# Altium project OMODRI.PrjPcb (part 2 of 5)

## Sheet OMODRI_Gate_Driver_2.SchDoc
size A3; SheetNumber: 2; SheetTotal: 4
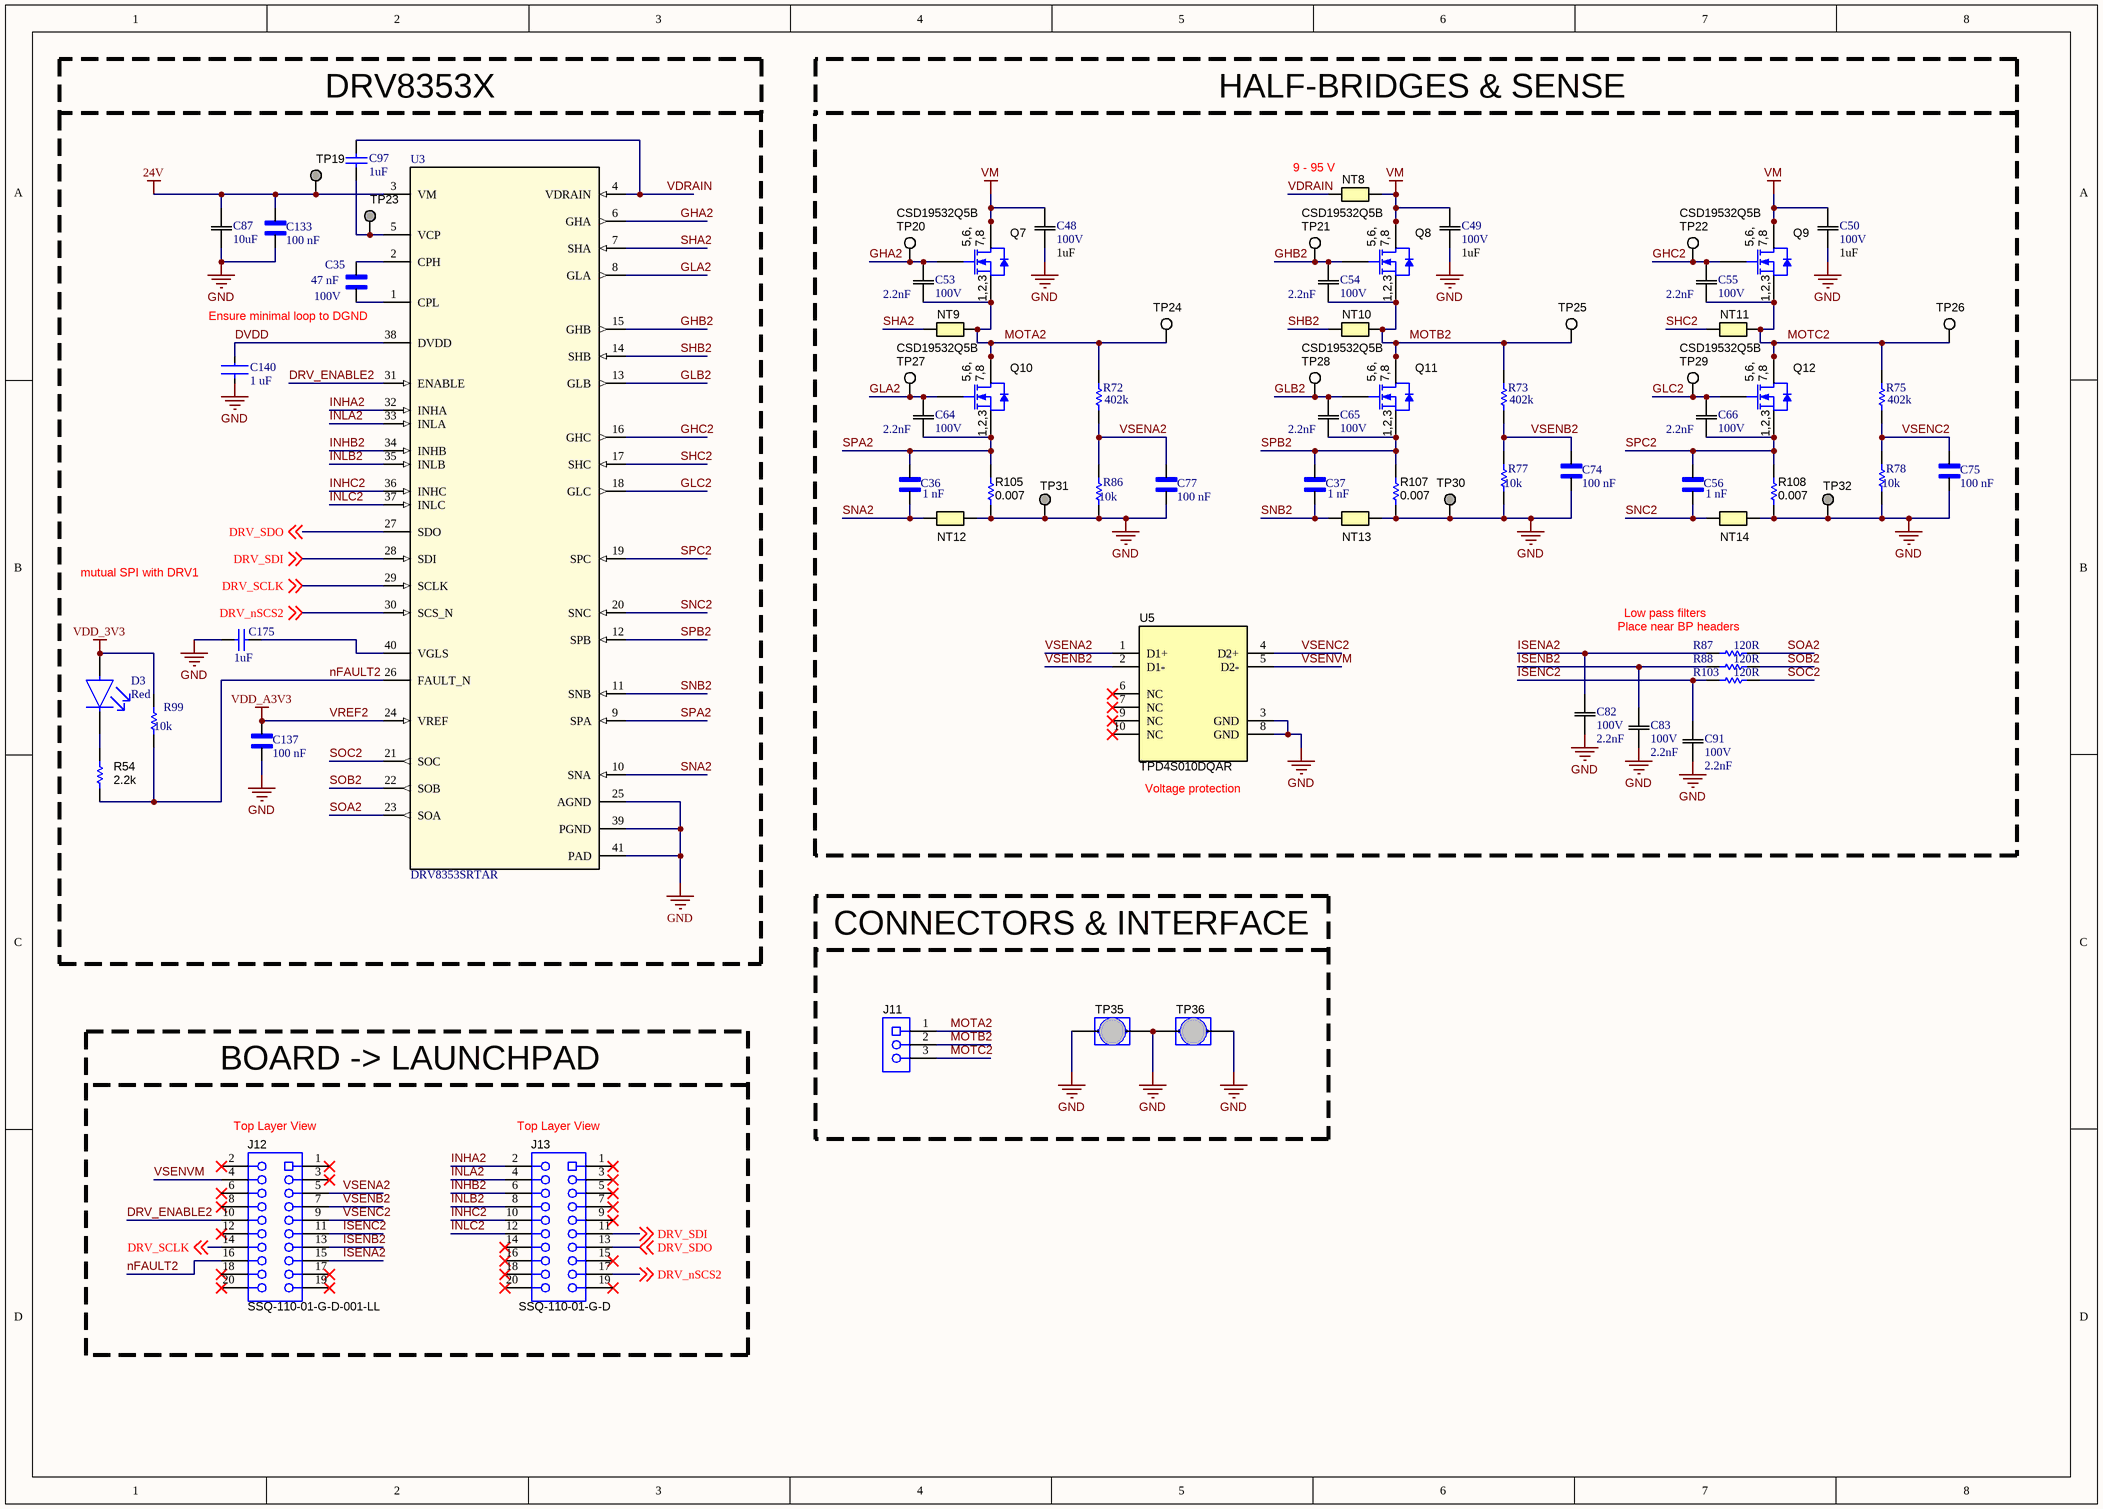
[diagram p1: OMODRI_Gate_Driver_2.SchDoc]

### Parts
C35  value 47 nF  Voltage: 100V  [CAPC1608X90N]  (hidden comment: GCG188R92A473KA01D)
C36  value 1 nF  [CAPC0603X33N]  (hidden comment: GRM033R71H102KA12D)
C37  value 1 nF  [CAPC0603X33N]  (hidden comment: GRM033R71H102KA12D)
C48  value 1uF  Voltage: 100V  [0805_AVX]  (hidden comment: Part Number: 08051C102K4Z2A)
C49  value 1uF  Voltage: 100V  [0805_AVX]  (hidden comment: Part Number: 08051C102K4Z2A)
C50  value 1uF  Voltage: 100V  [0805_AVX]  (hidden comment: Part Number: 08051C102K4Z2A)
C53  Voltage Rating (DC): 100V  Capacitance: 2.2nF  [CAP_1005]  (hidden comment: Part Number: C1005X8R2A222K050BA)
C54  Voltage Rating (DC): 100V  Capacitance: 2.2nF  [CAP_1005]  (hidden comment: Part Number: C1005X8R2A222K050BA)
C55  Voltage Rating (DC): 100V  Capacitance: 2.2nF  [CAP_1005]  (hidden comment: Part Number: C1005X8R2A222K050BA)
C56  value 1 nF  [CAPC0603X33N]  (hidden comment: GRM033R71H102KA12D)
C64  Voltage Rating (DC): 100V  Capacitance: 2.2nF  [CAP_1005]  (hidden comment: Part Number: C1005X8R2A222K050BA)
C65  Voltage Rating (DC): 100V  Capacitance: 2.2nF  [CAP_1005]  (hidden comment: Part Number: C1005X8R2A222K050BA)
C66  Voltage Rating (DC): 100V  Capacitance: 2.2nF  [CAP_1005]  (hidden comment: Part Number: C1005X8R2A222K050BA)
C74  value 100 nF  [CAPC0603X33N]  (hidden comment: GRM033R61E104KE14D)
C75  value 100 nF  [CAPC0603X33N]  (hidden comment: GRM033R61E104KE14D)
C77  value 100 nF  [CAPC0603X33N]  (hidden comment: GRM033R61E104KE14D)
C82  Voltage Rating (DC): 100V  Capacitance: 2.2nF  [CAP_1005]  (hidden comment: Part Number: C1005X8R2A222K050BA)
C83  Voltage Rating (DC): 100V  Capacitance: 2.2nF  [CAP_1005]  (hidden comment: Part Number: C1005X8R2A222K050BA)
C87  Capacitance: 10uF  [CAP_CL10]  (hidden comment: Part Number: CL10A106MA8NRNC)
C91  Voltage Rating (DC): 100V  Capacitance: 2.2nF  [CAP_1005]  (hidden comment: Part Number: C1005X8R2A222K050BA)
C97  value 1uF  [CAPC1005X55X25ML05T10]  (hidden comment: GRM155R61C105KA12D)
C133  value 100 nF  [CAPC0603X33N]  (hidden comment: GRM033R61E104KE14D)
C137  value 100 nF  [CAPC0603X33N]  (hidden comment: GRM033R61E104KE14D)
C140  value 1 uF  [FP-CC0201-BA-MFG]  (hidden comment: CC0201MRX5R5BB105)
C175  value 1uF  [CAPC1005X55X25ML05T10]  (hidden comment: GRM155R61C105KA12D)
D3  Colour: Red  [FP-SML-P1-MFG]  (hidden comment: SML-P11UTT86R)
J11  1904150  [Phoenix_1904150]  (value not drawn)
J12  SSQ-110-01-G-D-001-LL  [Samtec_SSQ-110-01-x-D-001-LL]
J13  SSQ-110-01-G-D  [Samtec_SSQ-110-01-x-D]
NT8  Net-Tie  [Net-Tie_50milWide_30milLong]  (value not drawn)  (net tie, no BOM)
NT9  Net-Tie  [Net-Tie_10mil]  (value not drawn)  (net tie, no BOM)
NT10  Net-Tie  [Net-Tie_10mil]  (value not drawn)  (net tie, no BOM)
NT11  Net-Tie  [Net-Tie_10mil]  (value not drawn)  (net tie, no BOM)
NT12  Net-Tie  [Net-Tie_10mil]  (value not drawn)  (net tie, no BOM)
NT13  Net-Tie  [Net-Tie_10mil]  (value not drawn)  (net tie, no BOM)
NT14  Net-Tie  [Net-Tie_10mil]  (value not drawn)  (net tie, no BOM)
Q7  CSD19532Q5B  [DNK0008A]
Q8  CSD19532Q5B  [DNK0008A]
Q9  CSD19532Q5B  [DNK0008A]
Q10  CSD19532Q5B  [DNK0008A]
Q11  CSD19532Q5B  [DNK0008A]
Q12  CSD19532Q5B  [DNK0008A]
R54  ValueDisplayed: 2.2k  [0402]  (hidden comment: CRCW04022K20JNED)
R72  Resistance: 402k  [RESC1005X40X25LL05T05]  (hidden comment: ERJ-2RKF4023X)
R73  Resistance: 402k  [RESC1005X40X25LL05T05]  (hidden comment: ERJ-2RKF4023X)
R75  Resistance: 402k  [RESC1005X40X25LL05T05]  (hidden comment: ERJ-2RKF4023X)
R77  Resistance: 10k  [RESC1005X40X25LL05T05]  (hidden comment: ERJ2RKF1002X)
R78  Resistance: 10k  [RESC1005X40X25LL05T05]  (hidden comment: ERJ2RKF1002X)
R86  Resistance: 10k  [RESC1005X40X25LL05T05]  (hidden comment: ERJ2RKF1002X)
R87  Resistance: 120R  [RESC1005X40X25ML05T10]  (hidden comment: CRCW0402120RJNEDHP)
R88  Resistance: 120R  [RESC1005X40X25ML05T10]  (hidden comment: CRCW0402120RJNEDHP)
R99  Resistance: 10k  [RESC1005X40X25LL05T05]  (hidden comment: ERJ2RKF1002X)
R103  Resistance: 120R  [RESC1005X40X25ML05T10]  (hidden comment: CRCW0402120RJNEDHP)
R105  ValueDisplayed: 0.007  [CRE2512-R5_R9]  (hidden comment: CRE2512-FZ-R007E-3)
R107  ValueDisplayed: 0.007  [CRE2512-R5_R9]  (hidden comment: CRE2512-FZ-R007E-3)
R108  ValueDisplayed: 0.007  [CRE2512-R5_R9]  (hidden comment: CRE2512-FZ-R007E-3)
TP19  TP_SM_1MM  [TP_SM_1MM]  (value not drawn)  (no BOM)
TP20  5002  [Keystone5002]  (value not drawn)
TP21  5002  [Keystone5002]  (value not drawn)
TP22  5002  [Keystone5002]  (value not drawn)
TP23  TP_SM_1MM  [TP_SM_1MM]  (value not drawn)  (no BOM)
TP24  5002  [Keystone5002]  (value not drawn)
TP25  5002  [Keystone5002]  (value not drawn)
TP26  5002  [Keystone5002]  (value not drawn)
TP27  5002  [Keystone5002]  (value not drawn)
TP28  5002  [Keystone5002]  (value not drawn)
TP29  5002  [Keystone5002]  (value not drawn)
TP30  TP_SM_1MM  [TP_SM_1MM]  (value not drawn)  (no BOM)
TP31  TP_SM_1MM  [TP_SM_1MM]  (value not drawn)  (no BOM)
TP32  TP_SM_1MM  [TP_SM_1MM]  (value not drawn)  (no BOM)
TP35  D3082-05  [Harwin_D3082-05]  (value not drawn)
TP36  D3082-05  [Harwin_D3082-05]  (value not drawn)
U3  DRV8353SRTAR  [RTA0040B]
U5  TPD4S010DQAR  [DQA0010A]

### Blocks framed on the sheet
BOARD -> LAUNCHPAD: J12 J13

### Nets
24V: C87.2 C133.2 TP19.1 U3.3(VM)
GND: C48.1 C49.1 C50.1 C74.1 C75.1 C77.1 C82.1 C83.1 C87.1 C91.1 C133.1 C137.1 C140.1 C175.2 NT12.2 NT13.2 NT14.2 R77.1 R78.1 R86.1 R105.1 R107.1 R108.1 TP30.1 TP31.1 TP32.1 TP35.1 TP35.2 TP36.1 TP36.2 U3.25(AGND) U3.39(PGND) U3.41(PAD) U5.3(GND) U5.8(GND)
VDD_3V3: D3.2(A) R99.2
VDD_A3V3: C137.2 U3.24(VREF)  [also labelled VREF2]  [project net VREF1]
VM: C48.2 C49.2 C50.2 NT8.2 Q7.5(D) Q7.6(D) Q7.7(D) Q7.8(D) Q7.9(D) Q8.5(D) Q8.6(D) Q8.7(D) Q8.8(D) Q8.9(D) Q9.5(D) Q9.6(D) Q9.7(D) Q9.8(D) Q9.9(D)
DRV_ENABLE2: J12.10 U3.31(ENABLE)
DRV_nSCS2: J13.17 U3.30(SCS_N) ; off-sheet DRV_nSCS2
DRV_SCLK: J12.14 U3.29(SCLK) ; off-sheet DRV_SCLK
DRV_SDI: J13.11 U3.28(SDI) ; off-sheet DRV_SDI
DRV_SDO: J13.13 U3.27(SDO) ; off-sheet DRV_SDO
DVDD: C140.2 U3.38(DVDD)
GHA2: C53.2 Q7.4(G) TP20.1 U3.6(GHA)
GHB2: C54.2 Q8.4(G) TP21.1 U3.15(GHB)
GHC2: C55.2 Q9.4(G) TP22.1 U3.16(GHC)
GLA2: C64.2 Q10.4(G) TP27.1 U3.8(GLA)
GLB2: C65.2 Q11.4(G) TP28.1 U3.13(GLB)
GLC2: C66.2 Q12.4(G) TP29.1 U3.18(GLC)
INHA2: J13.2 U3.32(INHA)
INHB2: J13.6 U3.34(INHB)
INHC2: J13.10 U3.36(INHC)
INLA2: J13.4 U3.33(INLA)
INLB2: J13.8 U3.35(INLB)
INLC2: J13.12 U3.37(INLC)
ISENA2: C82.2 J12.15 R87.2
ISENB2: C83.2 J12.13 R88.2
ISENC2: C91.2 J12.11 R103.2
MOTA2: C53.1 J11.1 NT9.2 Q7.1(S) Q7.2(S) Q7.3(S) Q10.5(D) Q10.6(D) Q10.7(D) Q10.8(D) Q10.9(D) R72.2 TP24.1
MOTB2: C54.1 J11.2 NT10.2 Q8.1(S) Q8.2(S) Q8.3(S) Q11.5(D) Q11.6(D) Q11.7(D) Q11.8(D) Q11.9(D) R73.2 TP25.1
MOTC2: C55.1 J11.3 NT11.2 Q9.1(S) Q9.2(S) Q9.3(S) Q12.5(D) Q12.6(D) Q12.7(D) Q12.8(D) Q12.9(D) R75.2 TP26.1
nFAULT2: J12.16 R54.1 R99.1 U3.26(FAULT_N)
SHA2: NT9.1 U3.7(SHA)
SHB2: NT10.1 U3.14(SHB)
SHC2: NT11.1 U3.17(SHC)
SNA2: C36.1 NT12.1 U3.10(SNA)
SNB2: C37.1 NT13.1 U3.11(SNB)
SNC2: C56.1 NT14.1 U3.20(SNC)
SOA2: R87.1 U3.23(SOA)
SOB2: R88.1 U3.22(SOB)
SOC2: R103.1 U3.21(SOC)
SPA2: C36.2 C64.1 Q10.1(S) Q10.2(S) Q10.3(S) R105.2 U3.9(SPA)
SPB2: C37.2 C65.1 Q11.1(S) Q11.2(S) Q11.3(S) R107.2 U3.12(SPB)
SPC2: C56.2 C66.1 Q12.1(S) Q12.2(S) Q12.3(S) R108.2 U3.19(SPC)
VDRAIN: C97.1 NT8.1 U3.4(VDRAIN)
VSENA2: C77.2 J12.5 R72.1 R86.2 U5.1(D1+)
VSENB2: C74.2 J12.7 R73.1 R77.2 U5.2(D1-)
VSENC2: C75.2 J12.9 R75.1 R78.2 U5.4(D2+)
VSENVM: J12.4 U5.5(D2-)
NetC35_1: C35.1 U3.1(CPL)
NetC35_2: C35.2 U3.2(CPH)
NetC97_2: C97.2 TP23.1 U3.5(VCP)
NetC175_1: C175.1 U3.40(VGLS)
NetD3_1: D3.1(C) R54.2

Not connected (* = marked no-connect by the designer): J12 1* 2* 3* 6* 8* 12* 17* 18* 19* 20*; J13 1* 3* 5* 7* 9* 14* 15* 16* 18* 19* 20*; U5 6(NC)* 7(NC)* 9(NC)* 10(NC)*

### Notes on the sheet
- (near C97) DRV8353X
- HALF-BRIDGES & SENSE
- (near NT8) 9 - 95 V
- (near C35) Ensure minimal loop to DGND
- mutual SPI with DRV1
- Low pass filters
- Place near BP headers
- (near U5) Voltage protection
- CONNECTORS & INTERFACE
- (near J12) Top Layer View
- (near J13) Top Layer View
- Title
- Size:
- Date:
- A3
- Number:
- Time:
- Revision:
- Sheet
- of
- File:
- (in symbol CMP-0000958-3) 5,6,; 7,8; 1,2,3

### Library data of the parts
C35 = GCG188R92A473KA01D: SMD Capacitor X8R_EIA_ with Capacitance: 47000pF Tol. 10%. Rated Voltage: 100Vdc; MF: Murata; Digi-Key_Part_Number: 490-GCG188R92A473KA01DCT-ND; SnapEDA_Link: https://www.snapeda.com/parts/GCG188R92A473KA01D/Murata/view-part/1805926/?ref=snap; Package: 1608 Murata; MP: GCG188R92A473KA01D; Digi-Key_Purchase_URL: https://www.digikey.com/product-detail/en/murata-electronics/GCG188R92A473KA01D/490-GCG188R92A473KA01DCT-ND/11619134?utm_source=snapeda&utm_medium=aggregator&utm_campaign=symbol
C36 C37 C56 = GRM033R71H102KA12D: SMD Capacitor X7R_EIA_ with Capacitance: 1000pF Tol. 10%. Rated Voltage: 50Vdc; MF: Murata; Digi-Key_Part_Number: 490-10682-1-ND; MP: GRM033R71H102KA12D; SnapEDA_Link: https://www.snapeda.com/parts/GRM033R71H102KA12D/Murata/view-part/4374985/?ref=snap; Package: 0603 Taiyo Yuden; Digi-Key_Purchase_URL: https://www.digikey.com/product-detail/en/murata-electronics/GRM033R71H102KA12D/490-10682-1-ND/5251423?utm_source=snapeda&utm_medium=aggregator&utm_campaign=symbol
C48-C50 = 08051C105K4Z2A: Cap Ceramic 1uF 100V X7R 10% Pad SMD 0805 Soft Termination 125C Automotive T/R; Manufacturer: Kyocera AVX; Vendor: AVX Corporation; Built_By: EMA_UL_Team; SourceLibrary: AVX_2015-1-12; Type: DEV; Manufacturer_Part_Number: 08051C102K4Z2A; Copyright: Copyright (C) 2018 Accelerated Designs. All rights reserved; RefDes: RefDes; Supplier 1: Digi-Key; Manufacturer Part Number: 08051C105K4Z2A; RoHS: No; Stock 1: 20840; Pricing 1: 1=0,47000, 10=0,32500, 100=0,19490, 500=0,14616, 1000=0,12343 (USD); Supplier Part Number 1: 478-12143-1-ND
C53-C55 C64-C66 C82 C83 C91 = C1005X8R2A222K05: CAP CER 2200PF 100V X8R 0402; Vendor: TDK; Built_By: EMA_UL_Team; Type: DEV; Tolerance: 10%; Manufacturer_Part_Number: C1005X8R2A222K050BA; Copyright: Copyright (C) 2018 Accelerated Designs. All rights reserved; RefDes: RefDes; Value: Value; Supplier 1: Digi-Key; Manufacturer: TDK; Manufacturer Part Number: C1005X8R2A222K050BA; RoHS: Yes; Category: Ceramic Capacitors; Stock 1: 14105; Pricing 1: 1=0,28000, 10=0,19000, 100=0,10750, 500=0,07590, 1000=0,06641, 2500=0,06325, 5000=0,05851 (USD); Mount: Surface Mount; Case/Package: 0402; Weight: 2.3E-05oz; Case Code (Imperial): 0402; Case Code (Metric): 1005; Min Operating Temperature: -55°C; Max Operating Temperature: 150°C; Packaging: Tape and Reel; Features: High Temperature; Termination: SMD/SMT; Package Quantity: 10000; Dielectric: X8R; Length: 0.039inch; Height: 0.5mm; Thickness: 0.022inch; Width: 0.5mm; ComponentLink1URL: http://www.mouser.com/ds/2/400/mlcc_commercial_hightemp_en-348760.pdf?src-supplier=Mouser; ComponentLink1Description: http://www.mouser.com/ds/2/400/mlcc_commercial_hightemp_en-348760.pdf?src-supplier=Mouser; ComponentLink2URL: http://product.tdk.com/en/catalog/datasheets/mlcc_commercial_hightemp_en.pdf?src-supplier=Avnet; ComponentLink2Description: http://product.tdk.com/en/catalog/datasheets/mlcc_commercial_hightemp_en.pdf?src-supplier=Avnet; ComponentLink3URL: https://product.tdk.com/info/en/catalog/datasheets/mlcc_commercial_hightemp_en.pdf?src-supplier=Digi-Key; ComponentLink3Description: https://product.tdk.com/info/en/catalog/datasheets/mlcc_commercial_hightemp_en.pdf?src-supplier=Digi-Key; ComponentLink4URL: https://product.tdk.com/info/en/catalog/spec/mlccspec_commercial_hightemp_en.pdf?src-supplier=Digi-Key; ComponentLink4Description: https://product.tdk.com/info/en/catalog/spec/mlccspec_commercial_hightemp_en.pdf?src-supplier=Digi-Key; Supplier Part Number 1: 445-15913-1-ND; Voltage Rating: 100V
C74 C75 C77 C133 C137 = GRM033R61E104KE14D: SMD Capacitor X5R_EIA_ with Capacitance: 0.10uF Tol. 10%. Rated Voltage: 25Vdc; MF: Murata; SnapEDA_Link: https://www.snapeda.com/parts/GRM033R61E104KE14D/Murata/view-part/4375622/?ref=snap; Availability: Unavailable; MP: GRM033R61E104KE14D; Package: 0603 Taiyo Yuden; Price: None
C87 = CL10A106MA8NRNC: CAP CER 10UF 25V X5R 0603; Vendor: Samsung; Built_By: EMA_Rocco; Type: DEV; Tolerance: 20%; Manufacturer_Part_Number: CL10A106MA8NRNC; Copyright: Copyright (C) 2018 Accelerated Designs. All rights reserved; RefDes: RefDes; Value: Value; Supplier 1: Digi-Key; Manufacturer: Samsung; Manufacturer Part Number: CL10A106MA8NRNC; RoHS: Yes; Category: Ceramic Capacitors; Stock 1: 30323; Pricing 1: 1=0,36000, 10=0,24900, 100=0,14120, 500=0,09966, 1000=0,08720 (USD); Mount: Surface Mount; Case/Package: 0603; Case Code (Imperial): 0603; Contact Plating: Tin; Case Code (Metric): 1608; Min Operating Temperature: -55°C; Max Operating Temperature: 85°C; Dielectric: X5R; Termination: Wraparound; Package Quantity: 1; Packaging: Tape and Reel; Voltage Rating: 25V; Length: 0.063inch; Thickness: 0.035inch; Width: 0.031inch; Lead Free: Lead Free; ComponentLink1URL: https://datasheet.ciiva.com/25766/cl10a106ma8nrnc-25766562.pdf?src-supplier=Digi-Key; ComponentLink1Description: https://datasheet.ciiva.com/25766/cl10a106ma8nrnc-25766562.pdf?src-supplier=Digi-Key
C97 C175 = CMP-2008-04573-1: Manufacturer: Murata; Part Number: GRM155R61C105KA12D
C140 = CMP-03422-000660-1: CAP CER 1UF 6.3V X5R 0201; Manufacturer: Yageo; Material: Ceramic; Tolerance: 0.2; Temperature Coefficient: 15%; Lead Free: Yes; Capacitance: 1 uF; ComponentLink2URL: http://www.yageo.com/documents/recent/UPY-GPHC_X5R_4V-to-50V_25.pdf; Footprint Url: http://www.yageo.com/exep/pages/download/literatures/UPY-C_GEN_24.pdf; Temperature Range Low: -55°C; Category: Cap; Device Class L3: Ceramic Capacitors; Device Class L2: Capacitors; Digikey Description: CAP CER 1UF 6.3V X5R 0201; Automotive: No; Temperature: -55°C to +85°C; RoHS: TRUE; Octopart: https://octopart.com/cc0201mrx5r5bb105-yageo-33242268; Height: 0.33mm; Temperature Range High: +85°C; Temperature Characteristic: X5R; Device Class L1: Passive Components; Package: CC0201-BA; ComponentLink2Description: Datasheet; Manufacturer Part Number: CC0201MRX5R5BB105; Voltage Rating: 6.3 V; Mouser Description: Multilayer Ceramic Capacitors MLCC - SMD/SMT 1.0uF 6.3V X5R 20%; Ipc Land Pattern Name: CAPC6030X30
D3 = SML-P11UTT86R: LED, PICOLED, Red, SMD, 1 mA, 1.8 V, 621 nm; Manufacturer Part Number: SML-P11VTT86R; Manufacturer: Rohm; Led Orientation: Top View; Power Dissipation: 50mW; Wavelength: 626nm; Forward Voltage: 1.8V; Forward Current: 1mA; Luminous Intensity: 4mcd; Reverse Voltage: 5V; Lens Color: Colorless; Lens Style: Square,Diffused,Colorless; Number of LEDs: 1; Lens Transparency: Clear; Dominant Wavelength: 621nm; ComponentLink2URL: https://www.rohm.com/datasheet/SML-P11VT(R)/sml-p11-e; Temperature: -40°C to +85°C; Device Class L2: LEDs; Package: SML-P1; Category: Diode; Automotive: No; RoHS: TRUE; Lead Free: Yes; Digikey Description: LED RED CLEAR 1006 SMD; Device Class L3: unset; ComponentLink2Description: Datasheet; Octopart: https://octopart.com/sml-p11vtt86r-rohm-34112314; Device Class L1: Optoelectronics; Temperature Range High: +85°C; Temperature Range Low: -40°C; Mouser Description: SML-P11 Series Red 0402 Clear 4 mcd 1.8 V Surface Mount PICOLED? LED; Height: 0.25mm; Supplier 1: Digi-Key; Stock 1: 132; Pricing 1: 1=0,39000, 10=0,27600, 100=0,16100, 500=0,11040, 1000=0,09200, 2500=0,08280 (USD); Mount: Surface Mount; Case/Package: 0402; Number of Pins: 2; Color: Red; Packaging: Cut Tape; Test Current: 1mA; Length: 1mm; Width: 0.6mm; REACH SVHC: Unknown; ComponentLink1URL: https://datasheet.ciiva.com/48679/sml-p11-p-eco-48679068.pdf?src-supplier=Avnet; ComponentLink1Description: https://datasheet.ciiva.com/48679/sml-p11-p-eco-48679068.pdf?src-supplier=Avnet; Supplier Part Number 1: SML-P11UTT86RCT-ND
J11 = CMP-0055528-1: Terminal Block, 9.52mm, 3x1, R/A, TH; Manufacturer: Phoenix Contact; Pitch_mm: 9.52; Gender: Female; Row_Count: 1; Current_A: 32A; Voltage_V: 1kV; Cert_UL: Y; CNHeader: FALSE; CT: TRUE; PartNumber: 1904150; PackageReference: Terminal Block, 3x1, Pitch 9.52mm; CompType: Terminal Block; RoHS: Y; MountType: TH; ComponentLink1Description: Datasheet URL; ComponentLink1URL: https://www.phoenixcontact.com/online/portal/in?uri=pxc-oc-itemdetail:pid=1904150&library=inen&pcck=P-11-01-05&tab=1; Publisher: Texas Instruments; LatestRevisionDate: 26/05/2017; Supplier 1: Digi-Key; Supplier Part Number 1: 277-6184-ND; Supplier 2: Newark; Supplier Part Number 2: 15X2516; Supplier 3: Mouser; Supplier Part Number 3: 651-1904150; Orientation: R/A; PinCount: 3; Color: Green; Cert_VDE: Y
J12 = CMP-0082628-1: Receptacle, 2.54mm, 10x2, Gold, TH; Manufacturer: Samtec; Pitch_mm: 2.54; Gender: Female; Cert_UL: Y; Voltage_V: 465V; Current_A: 6.3A; Row_Count: 2; CompType: Socket Strip; ComponentLink1Description: Datasheet URL; RoHS: Y; Orientation: Vertical; PackageReference: Receptacle, 2.54mm, 10x2, TH; Color: Black; PartNumber: SSQ-110-01-G-D-001-LL; PinCount: 20; ContactFinish: Gold; RowSpacing_mm: 2.54; ComponentLink1URL: http://suddendocs.samtec.com/catalog_english/ssq_th.pdf; MountType: TH
J13 = CMP-0082605-1: Receptacle, 2.54mm, 10x2, Gold, TH; Manufacturer: Samtec; Pitch_mm: 2.54; Gender: Female; Cert_UL: Y; Voltage_V: 465V; Current_A: 6.3A; Row_Count: 2; CompType: Socket Strip; ComponentLink1Description: Datasheet URL; RoHS: Y; Supplier Part Number 3: 1668306; Supplier 1: Digi-Key; Orientation: Vertical; PackageReference: Receptacle, 2.54mm, 10x2, TH; Color: Black; PartNumber: SSQ-110-01-G-D; PinCount: 20; Supplier Part Number 2: 11P8367; ContactFinish: Gold; Supplier 2: Newark; RowSpacing_mm: 2.54; ComponentLink1URL: http://suddendocs.samtec.com/prints/ssq-1xx-xx-xxx-x-xx-xxx-xx-x-mkt.pdf; MountType: TH; Supplier Part Number 1: SAM1179-10-ND; Supplier 3: Farnell
NT8-NT14 = CMP-0078142-1: Single point connection between nets.; MountType: SMT; PackageReference: N/A; CompType: Net-Tie; Manufacturer: N/A; PartNumber: N/A; Library Reference: Net-Tie
Q7-Q12 = CMP-0000958-3: MOSFET, N-CH, 100 V, 17 A, DNK0008A (VSON-CLIP-8); Manufacturer: Texas Instruments; Alternate Manufacturer: None; U/M: EA; ChType: N; Value: 100V; Value2: 48 nC; QgTyp_nC: 48; Vgs_V: 20V; IdsMax_A: 17A; SizeAreaWB_mm2: 56; SizeArea_mm2: 30; SizeX_mm: 6; SizeY_mm: 5; SizeZ_mm: 1; AEC Category: Q101; CompType: MOSFET; PartNumber: CSD19532Q5B; PackageReference: DNK0008A; VdsMax_V: 100V; RoHS: Y; MountType: SMT; ComponentLink1Description: Datasheet link; ComponentLink1URL: http://www.ti.com/lit/ds/symlink/csd19532q5b.pdf; Supplier 1: Digi-Key; Supplier Part Number 1: 296-37478-6-ND; Supplier 2: Farnell; Supplier Part Number 2: 2413268; AEC Qualified: N
R54 = CMP-0026890-5: RES, 2.2 k, 5%, 0.063 W, AEC-Q200 Grade 0, 0402; Manufacturer: Vishay-Dale; Power_W: 63mW; TempCo: 200 ppm/C; Value_Code: 2k20; Value: 2.2k; EIA_Code: E24; SizeX_mm: 1; SizeY_mm: 0.5; SizeZ_mm: 0.6; Value2: 0.063W; AEC Qualified: Y; VDC_V: 50V; AEC Category: Q200; AEC Grade: 0; Supplier Part Number 2: 59M6710; Supplier 2: Newark; Supplier Part Number 3: 71-CRCW0402J-2.2K-E3; Supplier 3: Mouser; RoHS: E; Value1: 5%; MountType: SMT; Supplier 1: Digi-Key; PackageReference: 0402; Tolerance_%: 5%; Res_ohm: 2.2k; SizeArea_mm2: 0.5; CompType: Resistor; PartNumber: CRCW04022K20JNED; ComponentLink1Description: Datasheet link; Supplier Part Number 1: 541-2.2KJCT-ND; Technology: Thick Film; ComponentLink1URL: http://www.vishay.com/docs/20035/dcrcwe3.pdf
R72 R73 R75 = CMP-2002-00920-1: RES SMD 402K OHM 1% 1/10W 0402; Manufacturer: Panasonic; Part Number: ERJ-2RKF4023X
R77 R78 R86 R99 = CMP-2000-07588-1: Chip Resistor, 10 KOhm, +/- 1%, 0.1 W, -55 to 155 degC, 0402 (1005 Metric), RoHS, Tape and Reel; Manufacturer: Panasonic; Power Rating: 100mW; Voltage Rating: 50V; Case\/Package: 0402; Temperature Coefficient: 100ppm\/degreesC; RoHSCompliant: True; Lead Free: LeadFree; Package Quantity: 1; Contact Plating: Tin; Length: 1mm; Radiation Hardening: No; REACH SVHC: NoSVHC; Max Operating Temperature: 155degC; Depth: 0.5mm; Case Code (Imperial): 0402; Military Standard: Not; Package Description: 2-Pin Surface Mount Device, Body 1 x 0.5 mm; Termination: SMD/SMT; Case Code (Metric): 1005; Height: 0.35mm; Packaging: TapeandReel; Voltage Rating (DC): 50V; Package Reference: 402; Number of Pins: 2; Tolerance: 1%; Mounting Technology: SurfaceMount; Width: 0.02inch; Mount: SurfaceMount; Datasheet URL: https://industrial.panasonic.com/cdbs/www-data/pdf/RDA0000/AOA0000C304.pdf; Composition: ThickFilm; Datasheet Version: 02/2017; Manufacturer URL: http://www.panasonic.com/; Max Power Dissipation: 100mW; Number of Terminations: 2; Min Operating Temperature: -55degC
R87 R88 R103 = CRCW0402120RJNEDHP: RES SMD 120 OHM 5% 1/5W 0402; Manufacturer: Vishay Dale; Power Rating: 125mW; Voltage Rating: 50V; Temperature Coefficient: 200ppm/°C; Part Number: CRCW0402120RJNEDHP; Supplier 1: Digi-Key; Manufacturer Part Number: CRCW0402120RJNEDHP; RoHS: Yes; Category: Chip SMD Resistors; Stock 1: 18750; Pricing 1: 1=0,13000, 10=0,11300, 100=0,04350, 1000=0,01912, 2500=0,01651, 5000=0,01477 (USD); Case/Package: 0402; Weight: 2.3E-05oz; Case Code (Metric): 1005; Case Code (Imperial): 0402; Min Operating Temperature: -55°C; Max Operating Temperature: 155°C; Package Quantity: 1; Tolerance: 5%; Packaging: Tape and Reel; Composition: Thick Film; Max Power Dissipation: 125mW; Features: Automotive AEC-Q200; Number of Terminations: 2; Termination: SMD/SMT; Military Standard: Not; Length: 1mm; Height: 0.016inch; Width: 0.02inch; Depth: 0.5mm; Lead Free: Lead Free; ComponentLink1URL: https://datasheet.ciiva.com/12577/crcwhpe3-46056-12577101.pdf?src-supplier=Mouser; ComponentLink1Description: https://datasheet.ciiva.com/12577/crcwhpe3-46056-12577101.pdf?src-supplier=Mouser; ComponentLink2URL: https://datasheet.ciiva.com/6548/crcwhpe3-6548111.pdf?src-supplier=Digi-Key; ComponentLink2Description: https://datasheet.ciiva.com/6548/crcwhpe3-6548111.pdf?src-supplier=Digi-Key; Supplier Part Number 1: 541-120YACT-ND
R105 R107 R108 = CMP-0074664-1: RES, 0.007, 1%, 3 W, AEC-Q200 Grade 0, 2512; Manufacturer: Bourns; Value: 0.007; Res_ohm: 7m; Value_Code: 7L000; Power_W: 3W; TempCo: 50 ppm/C; EIA_Code: E96; U/M: EA; AEC Category: Q200; AEC Grade: 0; AEC Qualified: Y; Green_Lifecycle: Active; Green_REACh: Passed; SizeArea_mm2: 21.6075; SizeX_mm: 6.45; SizeY_mm: 3.35; SizeZ_mm: 0.9; CompType: Resistor; PartNumber: CRE2512-FZ-R007E-3; PackageReference: 2512; RoHS: Y; Tolerance_%: 1%; Value1: 1%; Value2: 3W; MountType: SMT; Technology: Metal Film; Published: 2008-06-26; Publisher: Texas Instruments; LatestRevisionDate: 2017-06-26; ComponentLink1Description: Datasheet link; ComponentLink1URL: http://www.bourns.com/docs/Product-Datasheets/CRE.pdf; Supplier 1: Digi-Key; Supplier Part Number 1: CRE2512-FZ-R007E-3CT-ND; Supplier 2: Newark; Supplier Part Number 2: 78X4876; Supplier 3: Mouser; Supplier Part Number 3: 652-CRE2512FZR007E-3; Green_EU RoHS-2: Incomplete; Green_EU RoHS: Passed
TP19 TP23 TP30-TP32 = CMP-0003825-1: 1mm Test Point, SMT; Manufacturer: Any; ComponentLink1URL: https://sps06.itg.ti.com/sites/KMS/crossdivteams/altium/docs/ComponentDatasheets/PROBE_TEST_POINT.png; Key: TP_SM_1MM; Publisher: Texas Instruments; CompType: Test Point; PackageReference: 1mm Test Point, SMT; LatestRevisionDate: 2017-03-09; MountType: SMT; PartNumber: TP_SM_1MM; ComponentLink1Description: Datasheet Link
TP20-TP22 TP24-TP29 = CMP-0055139-1: Test Point, Miniature, White, TH; Manufacturer: Keystone; ContactFinish: Silver; CNHeader: FALSE; CT: TRUE; Green_Lifecycle: Active; Green_REACh: Passed; PartNumber: 5002; PackageReference: White Miniature Testpoint; CompType: Test Point; RoHS: Y; MountType: TH; ComponentLink1Description: Datasheet URL; ComponentLink1URL: http://www.keyelco.com/userAssets/file/M60-2p60.pdf; Publisher: Texas Instruments; LatestRevisionDate: 26/05/2017; Supplier 1: Digi-Key; Supplier Part Number 1: 36-5002-ND; Supplier 2: Newark; Supplier Part Number 2: 82H9632; Supplier 3: Mouser; Supplier Part Number 3: 534-5002; Color: White; Green_EU RoHS-2: Passed; Green_EU RoHS: Passed
TP35 TP36 = CMP-0075110-1: 1mm Uninsulated Shorting Plug, 10.16mm spacing, TH; Manufacturer: Harwin; CompType: Jumper Wire; CNHeader: False; Green_Lifecycle: Active; Green_REACh: Passed; PartNumber: D3082-05; PackageReference: Shorting Plug, 10.16mm spacing, TH; RoHS: Y; MountType: TH; ComponentLink1Description: Datasheet URL; ComponentLink1URL: http://cdn.harwin.com/pdfs/D3080-D3083.pdf; Publisher: Texas Instruments; LatestRevisionDate: 2017-07-12; Supplier 1: Digi-Key; Supplier Part Number 1: 952-1873-ND; Supplier 2: Newark; Supplier Part Number 2: 01E9240; Supplier 3: Mouser; Supplier Part Number 3: 855-D3082-05; CT: False; Green_EU RoHS-2: Passed; Green_EU RoHS: Passed with Exemption
U3 = DRV8353SRTAR: Manufacturer: Texas Instruments; PartNumber: DRV8353SRTAR; RefDes: RefDes; TYPE: TYPE; Value: Value; Supplier 1: Arrow; Manufacturer Part Number: DRV8353SRTAR; RoHS: No; Stock 1: 2000; Pricing 1: 2000=3,20540, 4000=3,09430, 10000=3,08440, 50000=3,06460 (USD); Supplier Part Number 1: DRV8353SRTAR
U5 = CMP-0043121-2: ESD Solution for High-Speed Differential Interface, 4 Channels, -40 to +85 degC,10-pin SON (DQA), Green (RoHS & no Sb/Br); Manufacturer: Texas Instruments; IO Leakage Current(nA): 10; IO Capacitance(Typ)(pF): 0.8; 1394 / Firewire: TRUE; Breakdown Voltage(Min)(V): 9; Differential Capacitance(pF): 0.05; IEC 61000-4-2 Contact(+/- kV): 8; ComponentLink1URL: http://www.ti.com/; PackageDescription: 10-Pin Plastic Small Outline No-Lead, 1 x 2.5 x 0.55 mm Body, 0.5 mm Pitch; ComponentLink2URL: http://www.ti.com/general/docs/lit/getliterature.tsp?genericPartNumber=TPD4S010&fileType=pdf; Serial ATA / eSATA: TRUE; ComponentLink3Description: URL Link1; Eco-Plan: Green (RoHS & no Sb/Br); ComponentLink2Description: Datasheet; ComponentLink3URL: SamplesURL:http://www.ti.com/product/tpd4s010#samples; PackageReference: DQA0010A; DatasheetVersion: SLVS817E; SubFamily: ESD Solution; PartNumber: TPD4S010DQAR; PackageVersion: revB, Sep-2009; Mounting Technology: Surface Mount; ComponentLink1Description: Manufacturer URL; IEC 61000-4-2 Air-Gap(+/- kV): 9

## Sheet OMODRI_QuadEnc.SchDoc
size A4
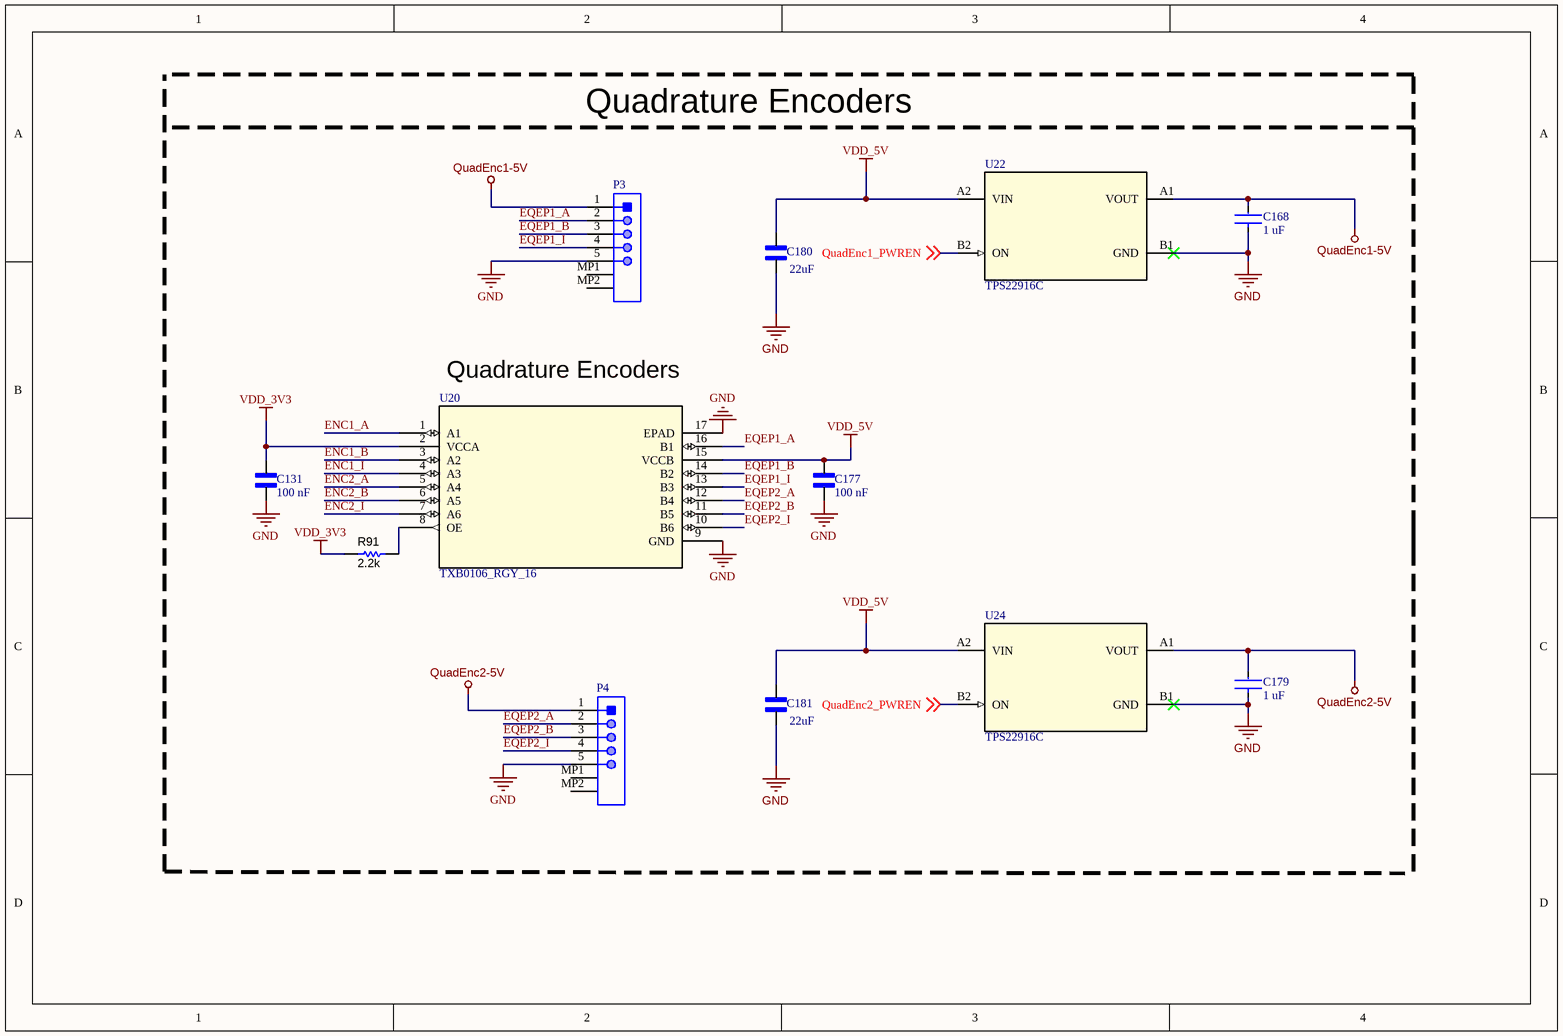
[diagram p2: OMODRI_QuadEnc.SchDoc]

### Parts
C131  value 100 nF  [CAPC0603X33N]  (hidden comment: GRM033R61E104KE14D)
C168  value 1 uF  [FP-CC0201-BA-MFG]  (hidden comment: CC0201MRX5R5BB105)
C177  value 100 nF  [CAPC0603X33N]  (hidden comment: GRM033R61E104KE14D)
C179  value 1 uF  [FP-CC0201-BA-MFG]  (hidden comment: CC0201MRX5R5BB105)
C180  value 22uF  [CAPC1005X55N]  (hidden comment: CL05A226MQ5N6J8)
C181  value 22uF  [CAPC1005X55N]  (hidden comment: CL05A226MQ5N6J8)
P3  BM05B-GHS-TBT(LF)(SN)  [JST-BM05B-GHS-TBT_V]  (value not drawn)
P4  BM05B-GHS-TBT(LF)(SN)  [JST-BM05B-GHS-TBT_V]  (value not drawn)
R91  ValueDisplayed: 2.2k  [0402]  (hidden comment: CRCW04022K20JNED)
U20  TXB0106_RGY_16  [RGY16_2P55X2P05]
U22  TPS22916C  [YFP0004ABAB]
U24  TPS22916C  [YFP0004ABAB]

### Nets
GND: C131.1 C168.1 C177.1 C179.1 C180.1 C181.1 P3.5 P4.5 U20.9(GND) U20.17(EPAD) U22.B1(GND) U24.B1(GND)
QuadEnc1-5V: C168.2 P3.1 U22.A1(VOUT)
QuadEnc2-5V: C179.2 P4.1 U24.A1(VOUT)
VDD_3V3: C131.2 R91.2 U20.2(VCCA)
VDD_5V: C177.2 C180.2 C181.2 U20.15(VCCB) U22.A2(VIN) U24.A2(VIN)
ENC1_A: U20.1(A1)
ENC1_B: U20.3(A2)
ENC1_I: U20.4(A3)
ENC2_A: U20.5(A4)
ENC2_B: U20.6(A5)
ENC2_I: U20.7(A6)
EQEP1_A: P3.2 U20.16(B1)
EQEP1_B: P3.3 U20.14(B2)
EQEP1_I: P3.4 U20.13(B3)
EQEP2_A: P4.2 U20.12(B4)
EQEP2_B: P4.3 U20.11(B5)
EQEP2_I: P4.4 U20.10(B6)
QuadEnc1_PWREN: U22.B2(ON) ; off-sheet QuadEnc1_PWREN
QuadEnc2_PWREN: U24.B2(ON) ; off-sheet QuadEnc2_PWREN
NetR91_1: R91.1 U20.8(OE)

Not connected (* = marked no-connect by the designer): P3 MP1 MP2; P4 MP1 MP2

### Notes on the sheet
- Quadrature Encoders

### Library data of the parts
C131 C177 = GRM033R61E104KE14D: as C74 on sheet OMODRI_Gate_Driver_2; SnapEDA_Link: https://www.snapeda.com/parts/GRM033R61E104KE14D/Murata/view-part/4375622/?ref=snap; Availability: Unavailable; MP: GRM033R61E104KE14D; Package: 0603 Taiyo Yuden; Price: None
C168 C179 = CMP-03422-000660-1: as C140 on sheet OMODRI_Gate_Driver_2; Lead Free: Yes; Capacitance: 1 uF; ComponentLink2URL: http://www.yageo.com/documents/recent/UPY-GPHC_X5R_4V-to-50V_25.pdf; Footprint Url: http://www.yageo.com/exep/pages/download/literatures/UPY-C_GEN_24.pdf; Temperature Range Low: -55°C; Category: Cap; Device Class L3: Ceramic Capacitors; Device Class L2: Capacitors; Digikey Description: CAP CER 1UF 6.3V X5R 0201; Automotive: No; Temperature: -55°C to +85°C; RoHS: TRUE; Octopart: https://octopart.com/cc0201mrx5r5bb105-yageo-33242268; Height: 0.33mm; Temperature Range High: +85°C; Temperature Characteristic: X5R; Device Class L1: Passive Components; Package: CC0201-BA; ComponentLink2Description: Datasheet; Manufacturer Part Number: CC0201MRX5R5BB105; Voltage Rating: 6.3 V; Mouser Description: Multilayer Ceramic Capacitors MLCC - SMD/SMT 1.0uF 6.3V X5R 20%; Ipc Land Pattern Name: CAPC6030X30
C180 C181 = CL05A226MQ5N6J8: 22µF ±20% 6.3V Ceramic Capacitor X5R 0402 (1005 Metric); MF: Samsung Electro-Mechanics; Package: 0402 Samsung Electro-Mechanics; Availability: Unavailable; MP: CL05A226MQ5N6J8; DigiKey-Purchase-URL: https://snapeda.com/shop?store=DigiKey&id=3601912; SnapEDA_Link: https://www.snapeda.com/parts/CL05A226MQ5N6J8/Samsung%20Electro-Mechanics/view-part/3601912/?ref=snap; Price: None
P3 P4 = CMP-2000-05958-1: GH Disconnectable Crimp Style Connector, Pitch 1.25 mm, 1 x 5 Position, Height 4.05 mm, -25 to 85 degC, RoHS, Tape and Reel; Manufacturer: JST; No of Positions: 5; Pitch: 1.25mm; Style/Orientation: StraightHeader/Plug; Package Reference: BM05B-GHS-TBT; Type: WiretoBoard; Datasheet URL: http://www.jst-mfg.com/product/pdf/eng/eGH.pdf; Termination: Crimp; Manufacturer URL: http://www.jst.com/home2.html; Mounting Technology: SurfaceMount; Datasheet Version: 05/2016; Package Description: GH Disconnectable Crimp Style Connector, Pitch 1.25 mm, 1 x 5 Position, Height 4.05 mm
R91 = CMP-0026890-5: as R54 on sheet OMODRI_Gate_Driver_2; Supplier Part Number 2: 59M6710; Supplier 2: Newark; Supplier Part Number 3: 71-CRCW0402J-2.2K-E3; Supplier 3: Mouser; RoHS: E; Value1: 5%; MountType: SMT; Supplier 1: Digi-Key; PackageReference: 0402; Tolerance_%: 5%; Res_ohm: 2.2k; SizeArea_mm2: 0.5; CompType: Resistor; PartNumber: CRCW04022K20JNED; ComponentLink1Description: Datasheet link; Supplier Part Number 1: 541-2.2KJCT-ND; Technology: Thick Film; ComponentLink1URL: http://www.vishay.com/docs/20035/dcrcwe3.pdf
U20 = TXB0106_RGY_16: Vendor: Texas Instruments; PACKAGE_DESIGNATOR: RGY; PIN_COUNT: 16; FAMILY_NAME: AUTO DIRECTION SENSING DUAL SUPPLY TRANSLATOR; INDUSTRY_STD_PKG_TYPE: VQFN; Manufacturer_Part_Number: txb0106_rgy_16; GENERIC_PART_NUMBER: TXB0106; Manufacturer: Texas Instruments; Datasheet_URL: http://www.ti.com/lit/gpn/TXB0106; Value: Value; Type: Type; RefDes: RefDes
U22 U24 = TPS22916C: TPS22916CY Single-Channel Ultra-Low Leakage Load Switch 2A 60 mO 1V to 5.5V 4-Pin DSBGA T/R; Manufacturer: Texas Instruments; Manufacturer Part Number: TPS22916CYFPR; Number of Channels: 1; Fault Protection: Reverse Current; Output Configuration: High Side; Supplier 1: Digi-Key; RoHS: No; Stock 1: 2282; Pricing 1: 1=0,42000, 10=0,36400, 25=0,33960, 100=0,25220, 250=0,21340, 500=0,20370, 1000=0,15035 (USD); Min Operating Temperature: -40°C; Max Operating Temperature: 85°C; Packaging: Tape and Reel; Number of Outputs: 1; Max Output Current: 2A; ComponentLink1URL: http://www.ti.com/lit/ds/symlink/tps22916.pdf?src-supplier=Digi-Key; ComponentLink1Description: http://www.ti.com/lit/ds/symlink/tps22916.pdf?src-supplier=Digi-Key; Supplier Part Number 1: 296-50065-1-ND

## Sheet OMODRI_BiSSEnc.SchDoc
size A3; Date: Not shown in title block; ApprovedBy: Not shown in title block; CheckedBy: Not shown in title block; Author: Not shown in title block; CompanyName: Not shown in title block; Engineer: Not shown in title block; Organization: Not shown in title block; Address1: Not shown in title block; Address2: Not shown in title block; Address3: Not shown in title block; Address4: Not shown in title block; DocumentNumber: 1; Revision: Use project parameter SCH_Rev; SheetNumber: 3; SheetTotal: 4; PageSetup: Record=PageOptions|CenterHorizontal=True|CenterVertical=True|PrintScale=1.00|XCorrection=1.00|YCorrection=1.00|PrintKind=0|BorderSize=5000000|LeftOffset=0|BottomOffset=0|Orientation=2|PaperLength=1000|PaperWidth=1000|Scale=100|PaperSource=15|PrintQuality=600|MediaType=1|DitherType=10|PaperKind=Letter|PrintScaleMode=1; CurrentTime: Not shown in title block; CurrentDate: Not shown in title block; Time: Not shown in title block; DocumentFullPathAndName: Not shown in title block; DocumentName: Not shown in title block; ModifiedDate: Not shown in title block; ImagePath: Not shown in title block
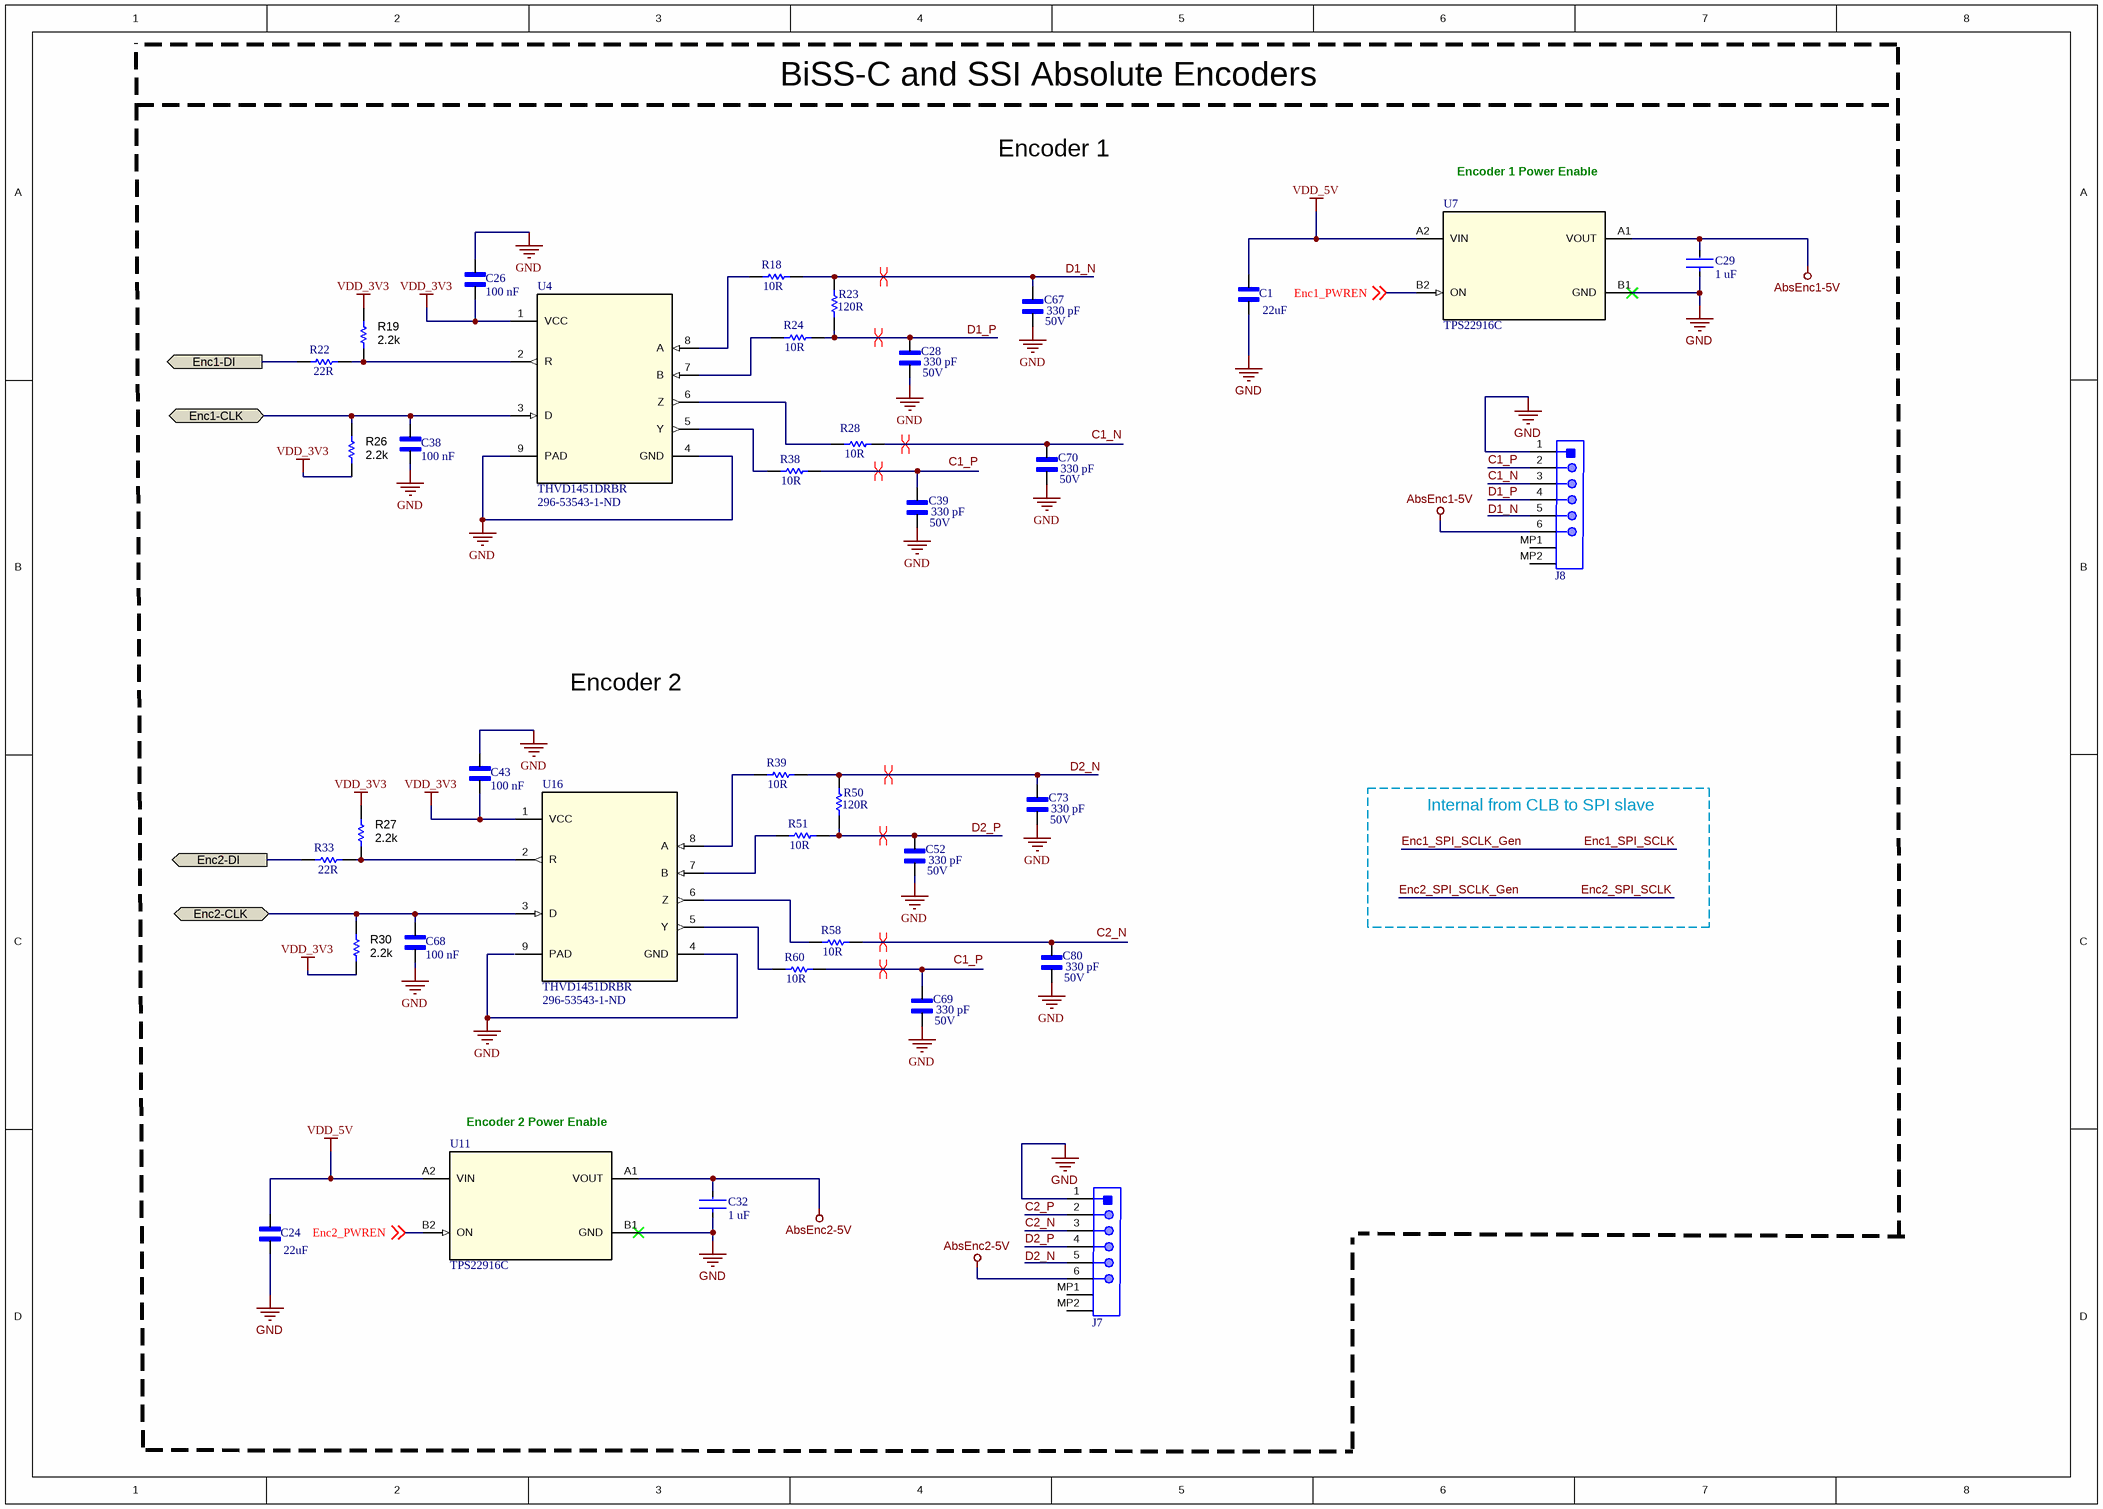
[diagram p3: OMODRI_BiSSEnc.SchDoc]

### Parts
C1  value 22uF  [CAPC1005X55N]  (hidden comment: CL05A226MQ5N6J8)
C24  value 22uF  [CAPC1005X55N]  (hidden comment: CL05A226MQ5N6J8)
C26  value 100 nF  [CAPC0603X33N]  (hidden comment: GRM033R61E104KE14D)
C28  value 330 pF  Voltage: 50V  [CAPC0603X33N]  (hidden comment: GRM033R71H331KA12D)
C29  value 1 uF  [FP-CC0201-BA-MFG]  (hidden comment: CC0201MRX5R5BB105)
C32  value 1 uF  [FP-CC0201-BA-MFG]  (hidden comment: CC0201MRX5R5BB105)
C38  value 100 nF  [CAPC0603X33N]  (hidden comment: GRM033R61E104KE14D)
C39  value 330 pF  Voltage: 50V  [CAPC0603X33N]  (hidden comment: GRM033R71H331KA12D)
C43  value 100 nF  [CAPC0603X33N]  (hidden comment: GRM033R61E104KE14D)
C52  value 330 pF  Voltage: 50V  [CAPC0603X33N]  (hidden comment: GRM033R71H331KA12D)
C67  value 330 pF  Voltage: 50V  [CAPC0603X33N]  (hidden comment: GRM033R71H331KA12D)
C68  value 100 nF  [CAPC0603X33N]  (hidden comment: GRM033R61E104KE14D)
C69  value 330 pF  Voltage: 50V  [CAPC0603X33N]  (hidden comment: GRM033R71H331KA12D)
C70  value 330 pF  Voltage: 50V  [CAPC0603X33N]  (hidden comment: GRM033R71H331KA12D)
C73  value 330 pF  Voltage: 50V  [CAPC0603X33N]  (hidden comment: GRM033R71H331KA12D)
C80  value 330 pF  Voltage: 50V  [CAPC0603X33N]  (hidden comment: GRM033R71H331KA12D)
J7  Conn_JST_BM06B-GHS-TBT_LF_SN_N_eec  [JST_BM06B-GHS-TBT_LF_SN_N_0]  (value not drawn)
J8  Conn_JST_BM06B-GHS-TBT_LF_SN_N_eec  [JST_BM06B-GHS-TBT_LF_SN_N_0]  (value not drawn)
R18  Resistance: 10R  [RESC1005X40X25ML05T10]  (hidden comment: CRCW040210R0FKEDHP)
R19  ValueDisplayed: 2.2k  [0402]  (hidden comment: CRCW04022K20JNED)
R22  value 22R  [RESC1005X40X25ML05T05]  (hidden comment: ERJ-2GEJ220X)
R23  Resistance: 120R  [RESC1005X40X25ML05T10]  (hidden comment: CRCW0402120RJNEDHP)
R24  Resistance: 10R  [RESC1005X40X25ML05T10]  (hidden comment: CRCW040210R0FKEDHP)
R26  ValueDisplayed: 2.2k  [0402]  (hidden comment: CRCW04022K20JNED)
R27  ValueDisplayed: 2.2k  [0402]  (hidden comment: CRCW04022K20JNED)
R28  Resistance: 10R  [RESC1005X40X25ML05T10]  (hidden comment: CRCW040210R0FKEDHP)
R30  ValueDisplayed: 2.2k  [0402]  (hidden comment: CRCW04022K20JNED)
R33  value 22R  [RESC1005X40X25ML05T05]  (hidden comment: ERJ-2GEJ220X)
R38  Resistance: 10R  [RESC1005X40X25ML05T10]  (hidden comment: CRCW040210R0FKEDHP)
R39  Resistance: 10R  [RESC1005X40X25ML05T10]  (hidden comment: CRCW040210R0FKEDHP)
R50  Resistance: 120R  [RESC1005X40X25ML05T10]  (hidden comment: CRCW0402120RJNEDHP)
R51  Resistance: 10R  [RESC1005X40X25ML05T10]  (hidden comment: CRCW040210R0FKEDHP)
R58  Resistance: 10R  [RESC1005X40X25ML05T10]  (hidden comment: CRCW040210R0FKEDHP)
R60  Resistance: 10R  [RESC1005X40X25ML05T10]  (hidden comment: CRCW040210R0FKEDHP)
U4  THVD1451DRBR  Supplier Part Number 1: 296-53543-1-ND  [DRB0008F]
U7  TPS22916C  [YFP0004ABAB]
U11  TPS22916C  [YFP0004ABAB]
U16  THVD1451DRBR  Supplier Part Number 1: 296-53543-1-ND  [DRB0008F]

### Ports
Enc1-CLK (bidir), Enc1-DI (out), Enc2-CLK (bidir), Enc2-DI (out)

### Nets
AbsEnc1-5V: C29.2 J8.6 U7.A1(VOUT)
AbsEnc2-5V: C32.2 J7.6 U11.A1(VOUT)
GND: C1.1 C24.1 C26.2 C28.1 C29.1 C32.1 C38.1 C39.1 C43.2 C52.1 C67.1 C68.1 C69.1 C70.1 C73.1 C80.1 J7.1 J8.1 U4.4(GND) U7.B1(GND) U11.B1(GND) U16.4(GND)
VDD_3V3: C26.1 C43.1 R19.2 R26.1 R27.2 R30.1 U4.1(VCC) U16.1(VCC)
VDD_5V: C1.2 C24.2 U7.A2(VIN) U11.A2(VIN)
C1_N: J8.3
C1_P: J8.2
C2_N: J7.3
C2_P: J7.2
D1_N: C67.2 R18.2 R23.2
D1_P: C28.2 J8.4 R23.1 R24.2
D2_N: C73.2 R39.2 R50.2
D2_P: C52.2 J7.4 R50.1 R51.2
Enc1_PWREN: U7.B2(ON) ; off-sheet Enc1_PWREN
Enc2_PWREN: U11.B2(ON) ; off-sheet Enc2_PWREN
NetC38_2: C38.2 R26.2 U4.3(D) ; port Enc1-CLK
NetC39_2: C39.2 R38.2
NetC68_2: C68.2 R30.2 U16.3(D) ; port Enc2-CLK
NetC69_2: C69.2 R60.2
NetC70_2: C70.2 R28.2
NetC80_2: C80.2 R58.2
NetR18_1: R18.1 U4.8(A)
NetR19_1: R19.1 R22.2 U4.2(R)
NetR22_1: R22.1 ; port Enc1-DI
NetR24_1: R24.1 U4.7(B)
NetR27_1: R27.1 R33.2 U16.2(R)
NetR28_1: R28.1 U4.6(Z)
NetR33_1: R33.1 ; port Enc2-DI
NetR38_1: R38.1 U4.5(Y)
NetR39_1: R39.1 U16.8(A)
NetR51_1: R51.1 U16.7(B)
NetR58_1: R58.1 U16.6(Z)
NetR60_1: R60.1 U16.5(Y)

Not connected (* = marked no-connect by the designer): J7 5 MP1 MP2; J8 5 MP1 MP2; U4 9(PAD); U16 9(PAD)

### Layout directives
differential pair: D1_N, D1_P, D2_N, D2_P, NetC39_2, NetC69_2, NetC70_2, NetC80_2

### Notes on the sheet
- BiSS-C and SSI Absolute Encoders
- Encoder 1
- Encoder 1 Power Enable
- Encoder 2
- Internal from CLB to SPI slave
- (near U11) Encoder 2 Power Enable
- Labels drawn without touching a wire or pin: C1_N, C1_P, C2_N, D1_N, D2_N
- Drawn By:
- SVN Rev:
- Number:
- TID #:
- Orderable:
- Rev:
- Sheet Title:
- File:
- Project Title:
- Designed for:
- Assembly Variant:
- Mod. Date:
- Sheet:
- Size:
- of
- B
- http://www.ti.com
- Texas Instruments and/or its licensors do not warrant the accuracy or completeness of this specification or any information contained therein. Texas Instruments and/or its licensors do not warrant that this design will meet the specifications, will be suitable for your application or fit for any particular purpose, or will operate in an implementation. Texas Instruments and/or its licensors do not warrant that the design is production worthy. You should completely validate and test your design implementation to confirm the system functionality for your application.
- Engineer:
- Contact:
- © Texas Instruments

### Library data of the parts
C1 C24 = CL05A226MQ5N6J8: as C180 on sheet OMODRI_QuadEnc; Package: 0402 Samsung Electro-Mechanics; Availability: Unavailable; MP: CL05A226MQ5N6J8; DigiKey-Purchase-URL: https://snapeda.com/shop?store=DigiKey&id=3601912; SnapEDA_Link: https://www.snapeda.com/parts/CL05A226MQ5N6J8/Samsung%20Electro-Mechanics/view-part/3601912/?ref=snap; Price: None
C26 C38 C43 C68 = GRM033R61E104KE14D: as C74 on sheet OMODRI_Gate_Driver_2; SnapEDA_Link: https://www.snapeda.com/parts/GRM033R61E104KE14D/Murata/view-part/4375622/?ref=snap; Availability: Unavailable; MP: GRM033R61E104KE14D; Package: 0603 Taiyo Yuden; Price: None
C28 C39 C52 C67 C69 C70 C73 C80 = GRM033R71H331KA12D: SMD Capacitor X7R_EIA_ with Capacitance: 330pF Tol. 10%. Rated Voltage: 50Vdc; MF: Murata; MP: GRM033R71H331KA12D; SnapEDA_Link: https://www.snapeda.com/parts/GRM033R71H331KA12D/Murata/view-part/1976079/?ref=snap; Digi-Key_Purchase_URL: https://www.digikey.com/product-detail/en/murata-electronics/GRM033R71H331KA12D/490-17085-1-ND/7602084?utm_source=snapeda&utm_medium=aggregator&utm_campaign=symbol; Digi-Key_Part_Number: 490-17085-1-ND; Package: 0603 Taiyo Yuden
C29 C32 = CMP-03422-000660-1: as C140 on sheet OMODRI_Gate_Driver_2; Lead Free: Yes; Capacitance: 1 uF; ComponentLink2URL: http://www.yageo.com/documents/recent/UPY-GPHC_X5R_4V-to-50V_25.pdf; Footprint Url: http://www.yageo.com/exep/pages/download/literatures/UPY-C_GEN_24.pdf; Temperature Range Low: -55°C; Category: Cap; Device Class L3: Ceramic Capacitors; Device Class L2: Capacitors; Digikey Description: CAP CER 1UF 6.3V X5R 0201; Automotive: No; Temperature: -55°C to +85°C; RoHS: TRUE; Octopart: https://octopart.com/cc0201mrx5r5bb105-yageo-33242268; Height: 0.33mm; Temperature Range High: +85°C; Temperature Characteristic: X5R; Device Class L1: Passive Components; Package: CC0201-BA; ComponentLink2Description: Datasheet; Manufacturer Part Number: CC0201MRX5R5BB105; Voltage Rating: 6.3 V; Mouser Description: Multilayer Ceramic Capacitors MLCC - SMD/SMT 1.0uF 6.3V X5R 20%; Ipc Land Pattern Name: CAPC6030X30
J7 J8 = Conn_JST_BM06B-GHS-TBT_LF_SN_N_eec: CONN HEADER GH TOP 6POS 1.25MM; Manufacturer: JST; Part Number: BM06B-GHS-TBT(LF)(SN)(N); helpURL: https://upverter.com/upn/revision/9caaf2120726c690/; ComponentLink2Description: Datasheet; Temperature: -25°C to +85°C; Package: HDR06; Supplier 2: Mouser; Price: 0.396190066284; Supplier 1: Digi-Key; ComponentLink1URL: https://upverter.com/upn/revision/9caaf2120726c690/; Supplier Part Number 1: 455-1582-1-ND; ComponentLink1Description: Upverter; ComponentLink2URL: http://www.jst-mfg.com/product/pdf/eng/eGH.pdf; RoHS: TRUE; Temperature Range High: +85°C; Digikey Description: CONN HEADER GH TOP 6POS 1.25MM; Digikey Part Number: 455-1582-1-ND; Temperature Range Low: -25°C; Lead Free: yes
R18 R24 R28 R38 R39 R51 R58 R60 = CRCW040210R0FKEDHP: SMD Chip Resistor, 0402 [1005 Metric], 10 ohm, CRCW-HP e3 Series, 50 V, Thick Film, 200 mW; Manufacturer: Vishay Dale; Voltage Rating (DC): 50V; Temperature Coefficient: 100ppm/°C; Tolerance: 1%; Power Rating: 125mW; Part Number: CRCW040210R0FKEDHP; Supplier 1: Digi-Key; Manufacturer Part Number: CRCW040210R0FKEDHP; RoHS: Yes; Category: Chip SMD Resistors; Stock 1: 25822; Pricing 1: 1=0,14000, 10=0,12600, 100=0,04840, 1000=0,02130, 2500=0,01839, 5000=0,01646 (USD); Mount: Surface Mount; Case/Package: 0402; Weight: 2.3E-05oz; Contact Plating: Tin; Case Code (Imperial): 0402; Case Code (Metric): 1005; Min Operating Temperature: -55°C; Max Operating Temperature: 155°C; Packaging: Tape and Reel; Voltage Rating: 50V; Package Quantity: 10000; Termination: SMD/SMT; Composition: Thick Film; Military Standard: Not; Length: 1mm; Height: 0.3mm; Width: 0.5mm; Depth: 0.5mm; Radiation Hardening: No; Lead Free: Lead Free; REACH SVHC: Unknown; ComponentLink1URL: https://datasheet.ciiva.com/5542/crcwhpe3-46056-5542142.pdf?src-supplier=Mouser; ComponentLink1Description: https://datasheet.ciiva.com/5542/crcwhpe3-46056-5542142.pdf?src-supplier=Mouser; Supplier Part Number 1: 541-10.0YCT-ND
R19 R26 R27 R30 = CMP-0026890-5: as R54 on sheet OMODRI_Gate_Driver_2; Supplier Part Number 2: 59M6710; Supplier 2: Newark; Supplier Part Number 3: 71-CRCW0402J-2.2K-E3; Supplier 3: Mouser; RoHS: E; Value1: 5%; MountType: SMT; Supplier 1: Digi-Key; PackageReference: 0402; Tolerance_%: 5%; Res_ohm: 2.2k; SizeArea_mm2: 0.5; CompType: Resistor; PartNumber: CRCW04022K20JNED; ComponentLink1Description: Datasheet link; Supplier Part Number 1: 541-2.2KJCT-ND; Technology: Thick Film; ComponentLink1URL: http://www.vishay.com/docs/20035/dcrcwe3.pdf
R22 R33 = CMP-2002-00486-1: Manufacturer: Panasonic; Part Number: ERJ-2GEJ220X
R23 R50 = CRCW0402120RJNEDHP: as R87 on sheet OMODRI_Gate_Driver_2; Part Number: CRCW0402120RJNEDHP; Supplier 1: Digi-Key; Manufacturer Part Number: CRCW0402120RJNEDHP; RoHS: Yes; Category: Chip SMD Resistors; Stock 1: 18750; Pricing 1: 1=0,13000, 10=0,11300, 100=0,04350, 1000=0,01912, 2500=0,01651, 5000=0,01477 (USD); Case/Package: 0402; Weight: 2.3E-05oz; Case Code (Metric): 1005; Case Code (Imperial): 0402; Min Operating Temperature: -55°C; Max Operating Temperature: 155°C; Package Quantity: 1; Tolerance: 5%; Packaging: Tape and Reel; Composition: Thick Film; Max Power Dissipation: 125mW; Features: Automotive AEC-Q200; Number of Terminations: 2; Termination: SMD/SMT; Military Standard: Not; Length: 1mm; Height: 0.016inch; Width: 0.02inch; Depth: 0.5mm; Lead Free: Lead Free; ComponentLink1URL: https://datasheet.ciiva.com/12577/crcwhpe3-46056-12577101.pdf?src-supplier=Mouser; ComponentLink1Description: https://datasheet.ciiva.com/12577/crcwhpe3-46056-12577101.pdf?src-supplier=Mouser; ComponentLink2URL: https://datasheet.ciiva.com/6548/crcwhpe3-6548111.pdf?src-supplier=Digi-Key; ComponentLink2Description: https://datasheet.ciiva.com/6548/crcwhpe3-6548111.pdf?src-supplier=Digi-Key; Supplier Part Number 1: 541-120YACT-ND
U4 U16 = THVD1451DRBR: Single Transmitter/Receiver RS-422/RS-485 8-Pin VSON EP T/R; Manufacturer: Texas Instruments; Simplex/Duplex: Full Duplex; PartNumber: THVD1451DRBR; RefDes: RefDes; TYPE: TYPE; Value: Value; Supplier 1: Digi-Key; Manufacturer Part Number: THVD1451DRBR; RoHS: No; Stock 1: 1028; Pricing 1: 1=2,66000, 10=2,38700, 25=2,25680, 100=1,85560, 250=1,66500, 500=1,60480, 1000=1,33399 (USD); Min Operating Temperature: -40°C; Max Operating Temperature: 125°C
U7 U11 = TPS22916C: as U22 on sheet OMODRI_QuadEnc; Supplier 1: Digi-Key; RoHS: No; Stock 1: 2282; Pricing 1: 1=0,42000, 10=0,36400, 25=0,33960, 100=0,25220, 250=0,21340, 500=0,20370, 1000=0,15035 (USD); Min Operating Temperature: -40°C; Max Operating Temperature: 85°C; Packaging: Tape and Reel; Number of Outputs: 1; Max Output Current: 2A; ComponentLink1URL: http://www.ti.com/lit/ds/symlink/tps22916.pdf?src-supplier=Digi-Key; ComponentLink1Description: http://www.ti.com/lit/ds/symlink/tps22916.pdf?src-supplier=Digi-Key; Supplier Part Number 1: 296-50065-1-ND